# EAGLE design IFE_POWER_DIST_V1 (EAGLE 9.2.2)
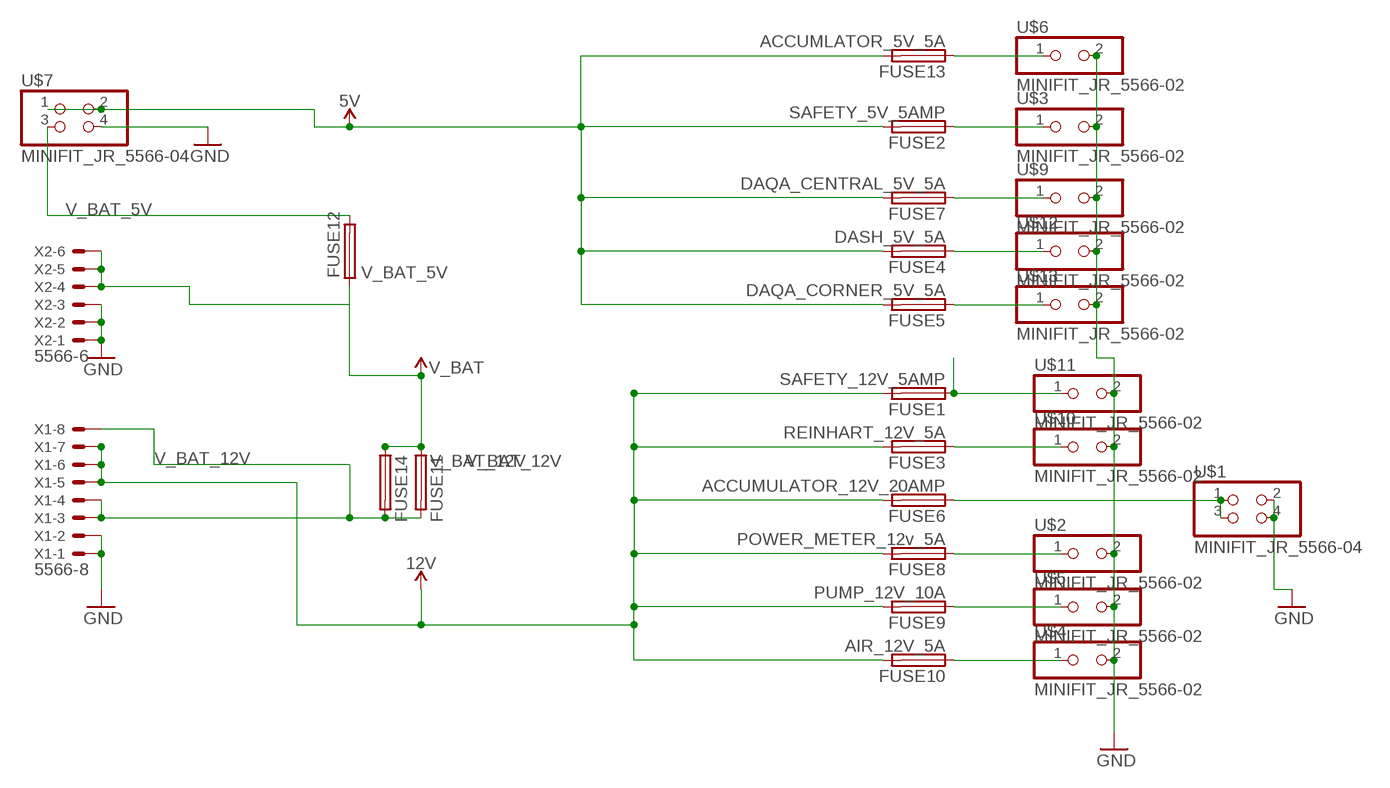
[diagram p0: schematic, sheet 1]

## Parts
FUSE1  SAFETY_12V_5AMP  MINI297-3568  [3568]
FUSE2  SAFETY_5V_5AMP  MINI297-3568  [3568]
FUSE3  REINHART_12V_5A  MINI297-3568  [3568]
FUSE4  DASH_5V_5A  MINI297-3568  [3568]
FUSE5  DAQA_CORNER_5V_5A  MINI297-3568  [3568]
FUSE6  ACCUMULATOR_12V_20AMP  MINI297-3568  [3568]
FUSE7  DAQA_CENTRAL_5V_5A  MINI297-3568  [3568]
FUSE8  POWER_METER_12v_5A  MINI297-3568  [3568]
FUSE9  PUMP_12V_10A  MINI297-3568  [3568]
FUSE10  AIR_12V_5A  MINI297-3568  [3568]
FUSE11  V_BAT_12V  MINI297-3568  [3568]
FUSE12  V_BAT_5V  MINI297-3568  [3568]
FUSE13  ACCUMLATOR_5V_5A  MINI297-3568  [3568]
FUSE14  V_BAT_12V  MINI297-3568  [3568]
U$1  MINIFIT_JR_5566-04  [MINIFIT_JR_5566-04]
U$2  MINIFIT_JR_5566-02  [MINIFIT_JR_5566-02]
U$3  MINIFIT_JR_5566-02  [MINIFIT_JR_5566-02]
U$4  MINIFIT_JR_5566-02  [MINIFIT_JR_5566-02]
U$5  MINIFIT_JR_5566-02  [MINIFIT_JR_5566-02]
U$6  MINIFIT_JR_5566-02  [MINIFIT_JR_5566-02]
U$7  MINIFIT_JR_5566-04  [MINIFIT_JR_5566-04]
U$9  MINIFIT_JR_5566-02  [MINIFIT_JR_5566-02]
U$10  MINIFIT_JR_5566-02  [MINIFIT_JR_5566-02]
U$11  MINIFIT_JR_5566-02  [MINIFIT_JR_5566-02]
U$12  MINIFIT_JR_5566-02  [MINIFIT_JR_5566-02]
U$13  MINIFIT_JR_5566-02  [MINIFIT_JR_5566-02]
X1  5566-8  [5566-8]
X2  5566-6  [5566-6]

## Nets
5V: FUSE2.P$2 FUSE2.P$3 FUSE4.P$2 FUSE4.P$3 FUSE5.P$2 FUSE5.P$3 FUSE7.P$2 FUSE7.P$3 FUSE13.P$2 FUSE13.P$3 U$7.1 U$7.2
12V: FUSE1.P$2 FUSE1.P$3 FUSE3.P$2 FUSE3.P$3 FUSE6.P$2 FUSE6.P$3 FUSE8.P$2 FUSE8.P$3 FUSE9.P$2 FUSE9.P$3 FUSE10.P$2 FUSE10.P$3 X1.5 X1.6 X1.7
GND: U$1.2 U$1.4 U$2.2 U$3.2 U$4.2 U$5.2 U$6.2 U$7.4 U$9.2 U$10.2 U$11.2 U$12.2 U$13.2 X1.1 X1.2 X2.1 X2.2 X2.3
N$1: FUSE5.P$1 FUSE5.P$4 U$13.1
N$2: FUSE7.P$1 FUSE7.P$4 U$9.1
N$3: FUSE4.P$1 FUSE4.P$4 U$12.1
N$4: FUSE2.P$1 FUSE2.P$4 U$3.1
N$5: FUSE10.P$1 FUSE10.P$4 U$4.1
N$6: FUSE1.P$1 FUSE1.P$4 U$11.1
N$7: FUSE3.P$1 FUSE3.P$4 U$10.1
N$8: FUSE8.P$1 FUSE8.P$4 U$2.1
N$9: FUSE9.P$1 FUSE9.P$4 U$5.1
N$10: FUSE6.P$1 FUSE6.P$4 U$1.1 U$1.3
N$11: FUSE13.P$1 FUSE13.P$4 U$6.1
V_BAT_5V: FUSE12.P$2 FUSE12.P$3 U$7.3
V_BAT_12V: FUSE11.P$2 FUSE11.P$3 FUSE14.P$2 FUSE14.P$3 X1.3 X1.4 X1.8
VCC: FUSE11.P$1 FUSE11.P$4 FUSE12.P$1 FUSE12.P$4 FUSE14.P$1 FUSE14.P$4 X2.4 X2.5 X2.6 ; supply symbol labelled V_BAT

## Library data of the parts
FUSE1-FUSE14 = Fuse:MINI297-3568
U$1 U$7 = Display_Custom:MINIFIT_JR_5566-04: Molex Minifit JR 5566-04 Vertical 4 position headder https://www.molex.com/pdm_docs/sd/039293026_sd.pdf
U$2-U$6 U$9-U$13 = Display_Custom:MINIFIT_JR_5566-02: Molex Minifit JR 5566-02 Vertical 2 position headder https://www.molex.com/pdm_docs/sd/039293026_sd.pdf
X1 = con-molex:5566-8: Mini FIT connector 8 pol Source: http://www.molex.com; MF: MOLEX; OC_FARNELL: unknown; OC_NEWARK: unknown
X2 = con-molex:5566-6: Mini FIT connector 6 pol Source: http://www.molex.com; MF: MOLEX; MPN: 95566-61002; OC_FARNELL: unknown; OC_NEWARK: 22K8620

## Board
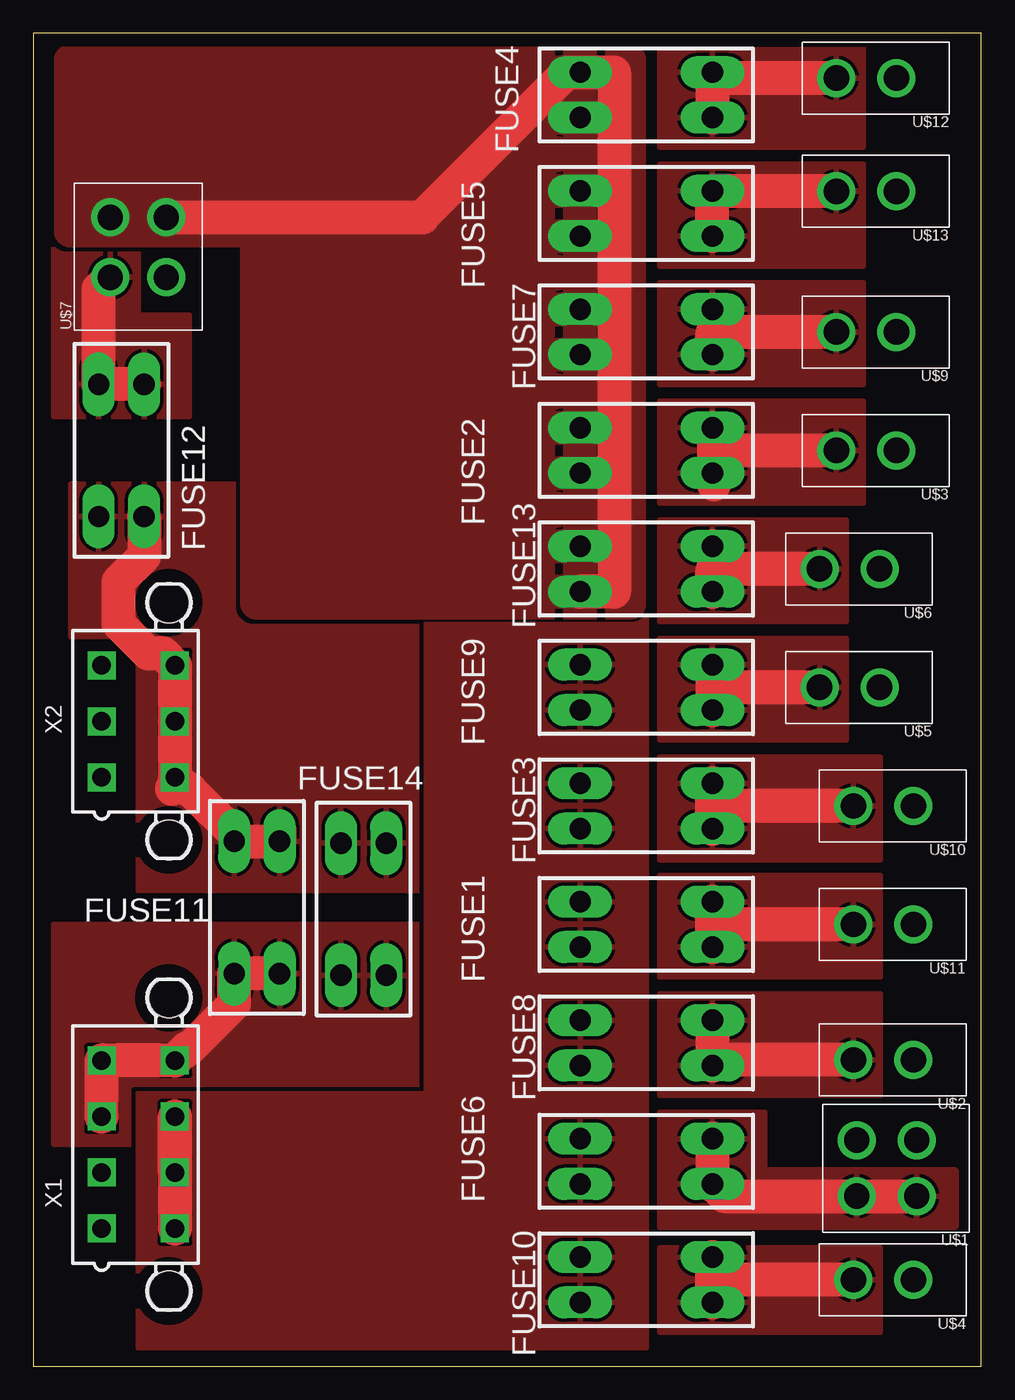
[diagram p1: board, top side]
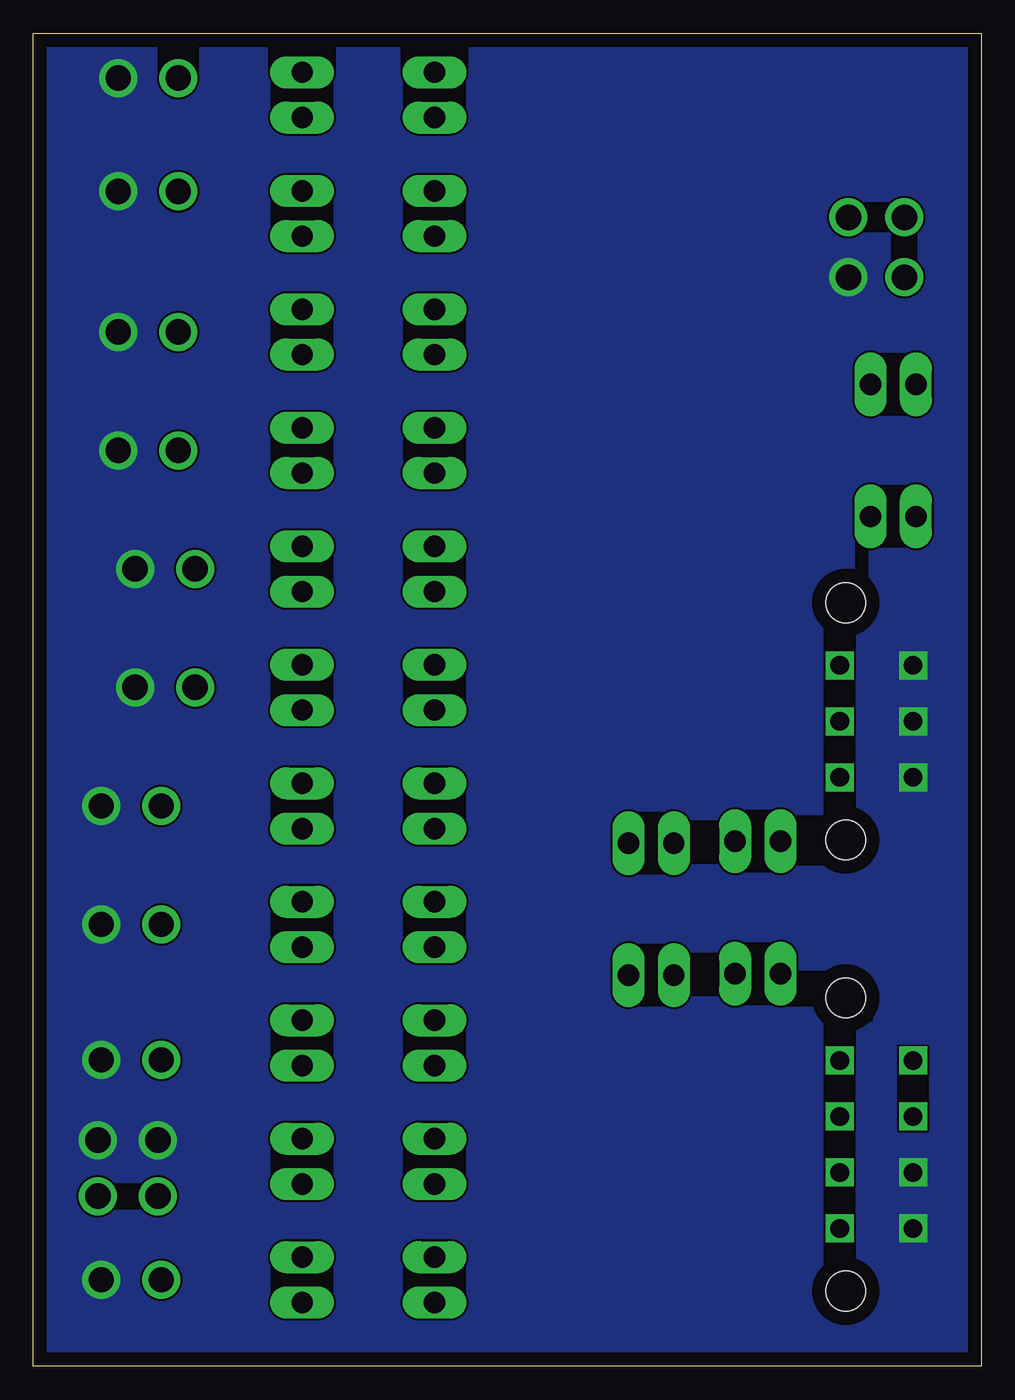
[diagram p2: board, bottom side, seen from below]

Size 71.1 x 100 mm. Coordinates in mm from the lower left corner, seen from the top.
Outline: 0,0 71.1,0 71.1,100 0,100 0,0
Copper layers (1*16): Top 0.035mm / dielectric 1.5mm / Bottom 0.035mm
Design rules "default": minimum track width 6mil, minimum drill 0.35mm, track to track 6mil, track to pad 6mil, pad to pad 6mil, via to via 6mil, smd to smd 6mil, copper to edge 40mil, drill to drill 6mil, minimum pad ring 10mil, minimum via ring 8mil, stop-mask expansion 4mil, vias tented up to drill 0mil, thermal gap 10mil

### Footprints (pad centres in the part's own frame; a part is rotated, then mirrored left to right if it is on the bottom)
3568 = drill 1.6 long: P$1 -4.96,1.7; P$2 4.96,1.7; P$3 4.96,-1.7; P$4 -4.96,-1.7
MINIFIT_JR_5566-04 = drill 1.9: 1 -2.1,2.25; 2 2.1,2.25; 3 -2.1,-2.25; 4 2.1,-2.25
MINIFIT_JR_5566-02 = drill 1.9: 1 0,2.25; 2 0,-2.25
5566-8 = drill 1.4 square: 1 6.3,-2.75; 2 2.1,-2.75; 3 -2.1,-2.75; 4 -6.3,-2.75; 5 6.3,2.75; 6 2.1,2.75; 7 -2.1,2.75; 8 -6.3,2.75 | hole 3: 11,2.29; -11,2.29
5566-6 = drill 1.4 square: 1 4.2,-2.75; 2 0,-2.75; 3 -4.2,-2.75; 4 4.2,2.75; 5 0,2.75; 6 -4.2,2.75 | hole 3: 8.9,2.29; -8.9,2.29

### Placement (x,y rotation side)
FUSE1  45.97,33.15 180 top
FUSE2  45.97,68.71 180 top
FUSE3  45.97,42.04 180 top
FUSE4  45.97,95.38 180 top
FUSE5  45.97,86.49 180 top
FUSE6  45.97,15.37 180 top
FUSE7  45.97,77.6 180 top
FUSE8  45.97,24.26 180 top
FUSE9  45.97,50.93 180 top
FUSE10  45.97,6.48 180 top
FUSE11  16.76,34.42 270 top
FUSE12  6.6,68.71 90 top
FUSE13  45.97,59.82 180 top
FUSE14  24.77,34.29 270 top
U$1  64.01,14.86 90 top
U$2  63.75,22.99 90 top
U$3  62.48,68.71 90 top
U$4  63.75,6.48 90 top
U$5  61.21,50.93 90 top
U$6  61.21,59.82 90 top
U$7  7.87,83.95 0 top
U$9  62.48,77.6 90 top
U$10  63.75,42.04 90 top
U$11  63.75,33.15 90 top
U$12  62.48,96.65 90 top
U$13  62.48,88.14 90 top
X1  7.87,16.64 270 top
X2  7.87,48.39 270 top

### Tracks (layer width: path | path; a pad name or v marks a point on that pad's centre or on a via)
5V
  Top 2.54: U$7.2 29.17,86.2 40.05,97.08 FUSE4.P$3 43.55,97.08 43.55,58.12 FUSE13.P$2
  pour Top (isolate 0.305): 44.7,97.92 2.79,97.92 2.79,85.22 16.76,85.22 16.76,57.28 44.7,57.28
12V
  Top 2.54: X1.5 X1.7 X1.6
  pour Top (rank 2): 45.97,56.01 29.46,56.01 29.46,20.45 7.87,20.45 7.87,1.4 45.97,1.4
GND
  pour Bottom: 0,99.06 0,0 71.12,0 71.12,99.06
N$1
  Top 2.54: U$13.1 50.98,88.14 | 50.98,88.14 FUSE5.P$4 | FUSE5.P$1 50.93,88.09 50.98,88.14
  pour Top: 62.23,90.17 46.99,90.17 46.99,82.55 62.23,82.55
N$2
  Top 2.54: U$9.1 51.05,77.6 | 51.05,77.6 51.05,79.18 FUSE7.P$4 | FUSE7.P$1 50.93,77.48 51.05,77.6
  pour Top: 62.23,81.28 46.99,81.28 46.99,73.66 62.23,73.66
N$3
  Top 2.54: U$12.1 51.05,96.65 50.93,96.53 FUSE4.P$1
  pour Top: 60.96,99.06 46.99,99.06 46.99,91.44 62.23,91.44 62.23,99.06
N$4
  Top 2.54: U$3.1 51.05,68.71 | 51.05,68.71 51.05,70.29 FUSE2.P$4 | FUSE2.P$1 51.05,66.89 | 51.05,66.89 51.05,66.17 | 51.05,66.89 51.05,68.71
  pour Top: 60.96,72.39 46.99,72.39 46.99,64.77 62.23,64.77 62.23,72.39
N$5
  Top 2.54: FUSE10.P$1 FUSE10.P$4 52.63,6.48 U$4.1
  pour Top: 46.99,8.89 63.5,8.89 63.5,2.54 46.99,2.54
N$6
  Top 2.54: FUSE1.P$1 FUSE1.P$4 52.63,33.15 U$11.1
  pour Top: 63.5,36.83 46.99,36.83 46.99,29.21 63.5,29.21
N$7
  Top 2.54: U$10.1 51.05,42.04 50.93,42.16 | 50.93,42.16 FUSE3.P$4 | FUSE3.P$1 50.93,42.16
  pour Top: 63.5,45.72 46.99,45.72 46.99,37.97 63.5,37.97
N$8
  Top 2.54: U$2.1 51.36,22.99 | 51.36,22.99 FUSE8.P$1 | FUSE8.P$4 50.93,23.42 51.36,22.99
  pour Top: 63.5,27.94 46.99,27.94 46.99,20.32 63.5,20.32
N$9
  Top 2.54: FUSE9.P$4 50.93,50.93 | 50.93,50.93 FUSE9.P$1 | U$5.1 50.93,50.93
  pour Top: 60.96,54.61 46.99,54.61 46.99,46.99 60.96,46.99
N$10
  Top 2.54: FUSE6.P$4 FUSE6.P$1 51.84,12.76 U$1.3 U$1.1
  pour Top: 46.99,19.05 46.99,10.41 69.09,10.41 69.22,10.54 69.22,14.61 69.09,14.73 54.99,14.73 54.86,14.86 54.86,19.05
N$11
  Top 2.54: U$6.1 51.05,59.82 | 51.05,59.82 51.05,61.4 FUSE13.P$4 | FUSE13.P$1 50.93,59.7 51.05,59.82
  pour Top: 60.96,63.5 46.99,63.5 46.99,55.88 60.96,55.88
V_BAT_5V
  Top 2.54: FUSE12.P$3 FUSE12.P$2 4.9,80.83 U$7.3
  pour Top (isolate 0.305, rank 2): 7.87,83.95 1.52,83.95 1.52,71.25 11.68,71.25 11.68,78.87 7.87,78.87
V_BAT_12V
  Top 2.54: FUSE11.P$2 FUSE11.P$3 15.06,27.18 11.73,23.85 11.54,23.85 X1.8 X1.4 X1.3
  pour Top (isolate 0.305, rank 3): 9.14,16.64 9.14,17.91 29.46,17.91 29.46,33.15 1.52,33.15 1.52,16.64
VCC
  Top 2.54: FUSE12.P$4 8.3,60.78 6.38,58.85 6.38,55.72 8.6,53.5 9.71,53.5 X2.6 10.62,43.52 10.41,43.31 | 18.46,40.21 FUSE11.P$1 15.24,39.37 15.24,39.77 11.73,43.27 11.54,43.27 X2.4
  pour Top (isolate 0.305, rank 3): 18.1,66.17 2.79,66.17 2.79,54.74 7.87,54.74 7.87,35.69 29.46,35.69 29.46,57.28 17.91,57.28